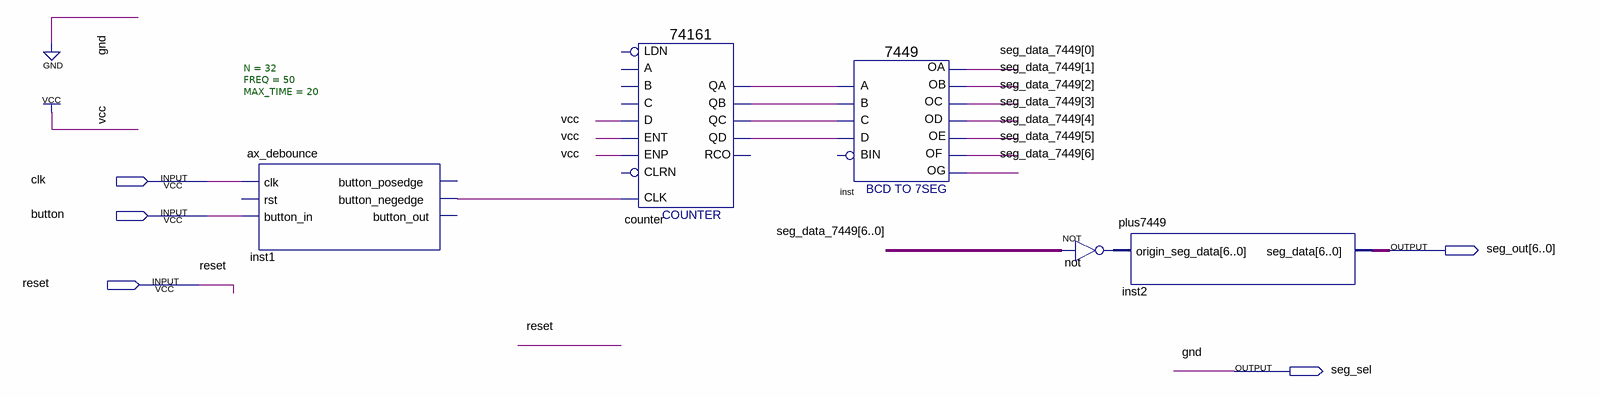
[diagram p0: schematic sheet]
// Quartus schematic NumbLockExp.bdf as structural Verilog: 5 symbols, 5 pins
module NumbLockExp (
  input  clk,
  input  button,
  input  reset,
  output [6:0] seg_out,
  output seg_sel
);

  wire counter_qa, counter_qb, counter_qc, counter_qd, inst1_button_negedge;
  wire [6:0] not_out, seg_data_7449;

  ax_debounce #(.N(32), .FREQ(50), .MAX_TIME(20)) inst1 (
    .clk(clk), .button_in(button), .button_negedge(inst1_button_negedge));  // open: rst, button_posedge, button_out
  \74161  counter (
    .CLK(inst1_button_negedge), .ENP(1'b1), .D(1'b1), .ENT(1'b1), .QD(counter_qd), .QC(counter_qc),
    .QB(counter_qb), .QA(counter_qa));  // open: CLRN, LDN, A, B, C, RCO
  \7449  inst (
    .A(counter_qa), .C(counter_qc), .B(counter_qb), .D(counter_qd), .OC(seg_data_7449[2]),
    .OD(seg_data_7449[3]), .OF(seg_data_7449[5]), .OG(seg_data_7449[6]), .OB(seg_data_7449[1]),
    .OA(seg_data_7449[0]), .OE(seg_data_7449[4]));  // open: BIN
  assign not_out = ~seg_data_7449;  // NOT not, 7 bits wide
  plus7449 inst2 (.origin_seg_data(not_out), .seg_data(seg_out));

  assign seg_sel = 1'b0;
endmodule
